# Altium schematic sheet Block Diagram.SchDoc
size A; DocumentNumber: 1; SheetNumber: 1; SheetTotal: 4
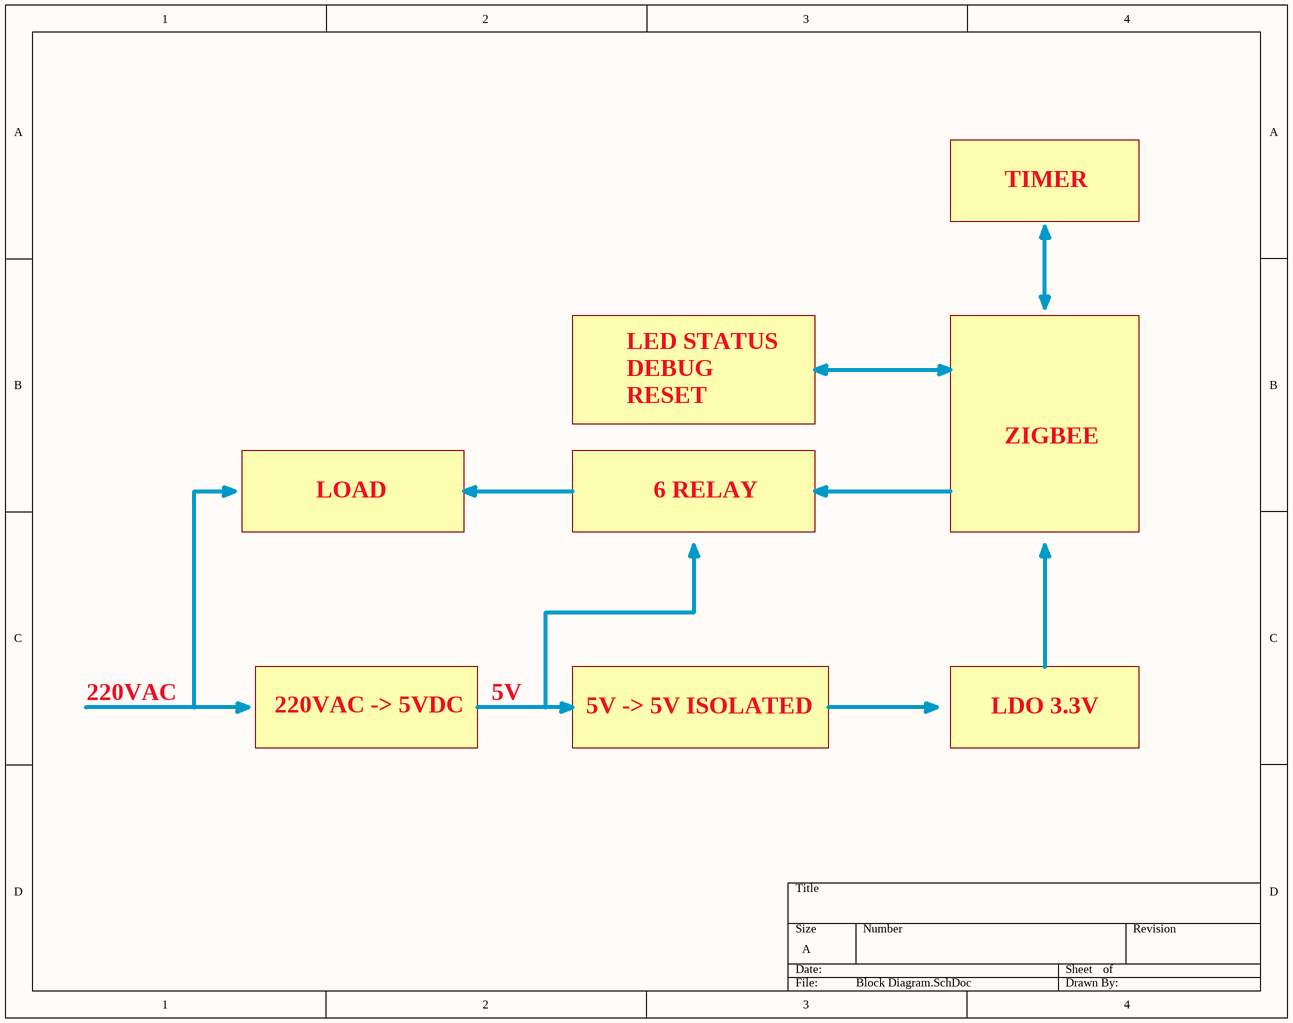
[diagram p0: Block Diagram.SchDoc]

## Notes on the sheet
- TIMER
- LED STATUS
- DEBUG
- RESET
- LOAD
- 6 RELAY
- ZIGBEE
- 220VAC
- 5V
- 220VAC -> 5VDC
- 5V -> 5V ISOLATED
- LDO 3.3V